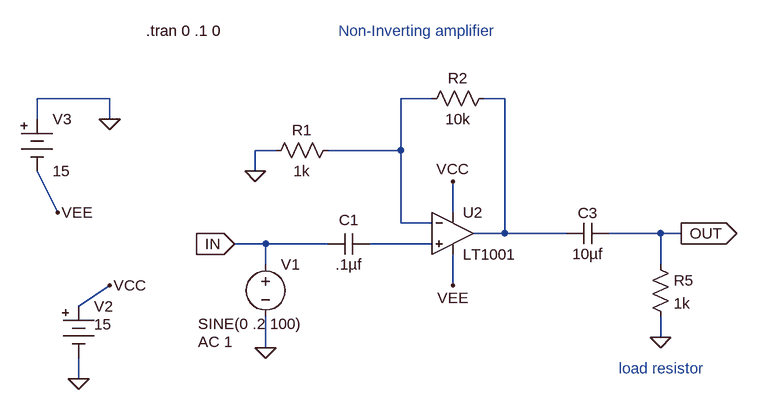
[diagram p0: schematic lab06b-Op-amp-non-inverting.asc]
lab06b-Op-amp-non-inverting.asc, the LTspice schematic file:
Version 4
SHEET 1 880 680
WIRE -272 -48 -384 -48
WIRE 224 -48 176 -48
WIRE 336 -48 304 -48
WIRE -384 -16 -384 -48
WIRE -272 -16 -272 -48
WIRE -16 32 -48 32
WIRE 176 32 176 -48
WIRE 176 32 64 32
WIRE -48 64 -48 32
WIRE -352 128 -384 64
WIRE 256 128 256 80
WIRE 176 144 176 32
WIRE 224 144 176 144
WIRE 336 160 336 -48
WIRE 336 160 288 160
WIRE 432 160 336 160
WIRE 576 160 496 160
WIRE 608 160 576 160
WIRE -32 176 -80 176
WIRE 64 176 -32 176
WIRE 224 176 128 176
WIRE -32 208 -32 176
WIRE 576 208 576 160
WIRE 256 240 256 192
WIRE -320 272 -272 240
WIRE 576 320 576 288
WIRE -32 336 -32 288
WIRE -320 384 -320 352
FLAG -320 384 0
FLAG 256 80 VCC
FLAG -272 240 VCC
FLAG -80 176 IN
IOPIN -80 176 In
FLAG 608 160 OUT
IOPIN 608 160 Out
FLAG -32 336 0
FLAG 576 320 0
FLAG -272 -16 0
FLAG -352 128 VEE
FLAG 256 240 VEE
FLAG -48 64 0
SYMBOL res -32 48 R270
WINDOW 0 32 56 VTop 0
WINDOW 3 0 56 VBottom 0
SYMATTR InstName R1
SYMATTR Value 1k
SYMBOL res 208 -32 R270
WINDOW 0 32 56 VTop 0
WINDOW 3 0 56 VBottom 0
SYMATTR InstName R2
SYMATTR Value 10k
SYMBOL cap 64 192 R270
WINDOW 0 37 32 VTop 0
WINDOW 3 0 32 VBottom 0
SYMATTR InstName C1
SYMATTR Value .1µf
SYMBOL cap 432 176 R270
WINDOW 0 32 32 VTop 0
WINDOW 3 0 32 VBottom 0
SYMATTR InstName C3
SYMATTR Value 10µf
SYMBOL Misc\\battery -320 256 R0
WINDOW 3 24 44 Left 0
WINDOW 123 0 0 Left 0
WINDOW 39 0 0 Left 0
SYMATTR Value 15
SYMATTR InstName V2
SYMBOL voltage -32 192 R0
WINDOW 3 -104 107 Left 0
WINDOW 123 -104 135 Left 0
WINDOW 39 0 0 Left 0
SYMATTR Value SINE(0 .2 100)
SYMATTR Value2 AC 1
SYMATTR InstName V1
SYMBOL res 560 192 R0
SYMATTR InstName R5
SYMATTR Value 1k
SYMBOL Misc\\battery -384 -32 R0
WINDOW 123 0 0 Left 0
WINDOW 39 0 0 Left 0
SYMATTR InstName V3
SYMATTR Value 15
SYMBOL Opamps\\LT1001 256 96 R0
SYMATTR InstName U2
TEXT -216 -152 Left 0 !.tran 0 .1 0
TEXT 80 -152 Left 0 ;Non-Inverting amplifier
TEXT 512 368 Left 0 ;load resistor

The netlist it stands for:
* lab06b-Op-amp-non-inverting.asc
R1 0 N001 1k
R2 N001 N002 10k
C1 IN N003 .1µf
C3 N002 OUT 10µf
V2 VCC 0 15
V1 IN 0 SINE(0 .2 100) AC 1
R5 OUT 0 1k
V3 0 VEE 15
XU2 N003 N001 VCC VEE N002 LT1001  ; pins In+ In- V+ V- OUT
.tran 0 .1 0
* Non-Inverting amplifier
* load resistor
.lib LTC.lib
.backanno
.end